# EAGLE design open-V2 (EAGLE 8.0.0)
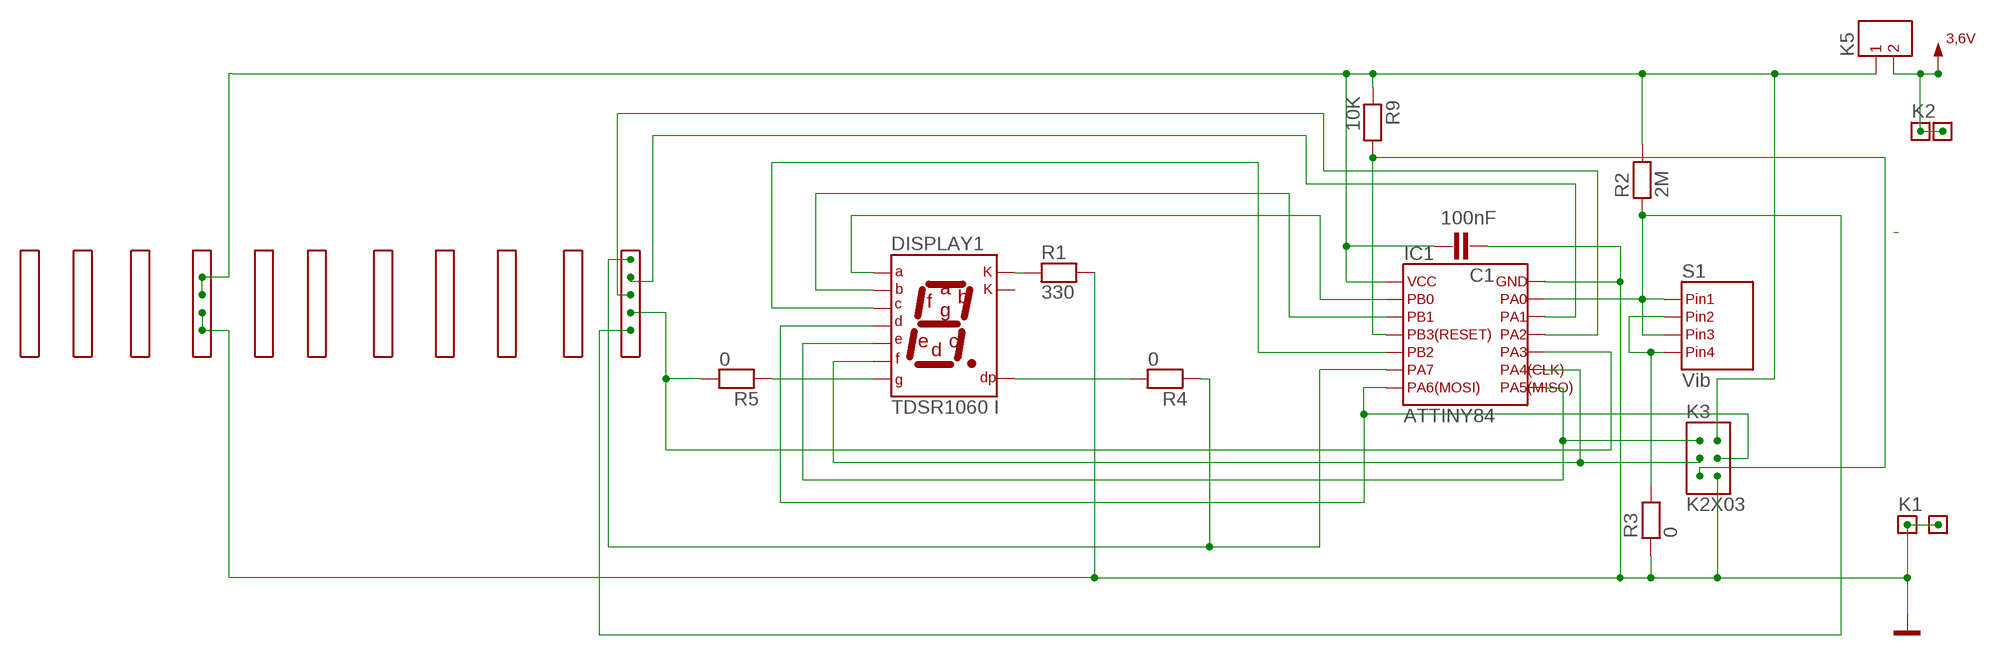
[diagram p0: schematic, sheet 1]

## Parts
C1  100nF  C1  [C1]
DISPLAY1  TDSR1060 I  DISPLAY1  [DISPLAY1]
IC1  ATTINY84  IC1  [IC1]
K1  K1  [K1]
K2  K2  [K2]
K3  K2X03  K3  [K3]
K4  K4  [K4]
K5  K5  [K5]
K6  K6  [K6]
K7  K7  [K7]
K8  K8  [K8]
K9  K9  [K9]
K10  K10  [K10]
K11  K11  [K11]
K12  K12  [K12]
K13  K13  [K13]
K14  K14  [K14]
K15  K15  [K15]
K16  K16  [K16]
K18  K18  [K18]
R1  330  R1  [R1]
R2  2M  R2  [R2]
R3  0  R3  [R3]
R4  0  R4  [R4]
R5  0  R5  [R5]
R9  10K  R9  [R9]
S1  Vib  S1  [S1]

## Nets
1: DISPLAY1.1(G) R5.1
3,6V: K2.1 K5.2 K18.1 ; supply symbol labelled VCC_1
A: DISPLAY1.10(A) IC1.2(PB0)
B: DISPLAY1.9(B) IC1.3(PB1)
C: DISPLAY1.7(C) IC1.5(PB2)
D/MOSI: DISPLAY1.5(D) IC1.7(PA6(MOSI)) K3.4
DP: DISPLAY1.6(DP) R4.2
E/MISO: DISPLAY1.4(E) IC1.8(PA5(MISO)) K3.1
F/CLK: DISPLAY1.2(F) IC1.9(PA4(CLK)) K3.3
G: IC1.10(PA3) K10.3 R5.2
GND: C1.1 IC1.14(GND) K1.1 K3.6 K13.2 K13.3 K16.1 R1.2 R3.1
K: DISPLAY1.3(K) R1.1
PA0: IC1.13(PA0) K10.2 R2.1 S1.1(PIN1) S1.3(PIN3)
PA1: IC1.12(PA1) K10.5
PA2: IC1.11(PA2) K10.4
PA7: IC1.6(PA7) K10.6 R4.1
RST: IC1.4(PB3(RESET)) K3.5 R9.2
SIG$25: R3.2 S1.2(PIN2) S1.4(PIN4)
VCC: C1.2 IC1.1(VCC) K3.2 K5.1 K13.4 K13.5 R2.2 R9.1
Unconnected: DISPLAY1.8(K) K4.1 K4.2 K4.3 K4.4 K4.5 K4.6 K6.1 K6.2 K6.3 K6.4 K6.5 K6.6 K7.1 K7.2 K7.3 K7.4 K7.5 K7.6 K8.1 K8.2 K8.3 K8.4 K8.5 K8.6 K9.1 K9.2 K9.3 K9.4 K9.5 K9.6 K10.1 K11.1 K11.2 K11.3 K11.4 K11.5 K11.6 K12.1 K12.2 K12.3 K12.4 K12.5 K12.6 K13.1 K13.6 K14.1 K14.2 K14.3 K14.4 K14.5 K14.6 K15.1 K15.2 K15.3 K15.4 K15.5 K15.6

## Library data of the parts
C1 = open-V2:C1: Bedrahtete Keramikkondensatoren, X7R/Z5U/Y5U, Kondensator 50V , B37982-N5104-M [100NF]
DISPLAY1 = open-V2:DISPLAY1: LED-Anzeigen, 10 mm, SA39-11EWA..., 7-Segment LED-Anzeige hyperrot, SC39-11SRWA [10MM]
IC1 = open-V2:IC1: 8-bit AVR Microcontroller with 2K Bytes In-System Programmable Flash
K1 = open-V2:K1: Pfostensteckverbinder 1-polig RM2,54
K2 = open-V2:K2: Pfostensteckverbinder 1-polig RM2,54
K3 = open-V2:K3: Pfostensteckverbinder 2x3-polig RM2,54
K4 = open-V2:K4: Pfostensteckverbinder 6-polig RM2,54
K5 = open-V2:K5: Jumper 2pol
K6 = open-V2:K6: Pfostensteckverbinder 6-polig RM2,54
K7 = open-V2:K7: Pfostensteckverbinder 6-polig RM2,54
K8 = open-V2:K8: Pfostensteckverbinder 6-polig RM2,54
K9 = open-V2:K9: Pfostensteckverbinder 6-polig RM2,54
K10 = open-V2:K10: Pfostensteckverbinder 6-polig RM2,54
K11 = open-V2:K11: Pfostensteckverbinder 6-polig RM2,54
K12 = open-V2:K12: Pfostensteckverbinder 6-polig RM2,54
K13 = open-V2:K13: Pfostensteckverbinder 6-polig RM2,54
K14 = open-V2:K14: Pfostensteckverbinder 6-polig RM2,54
K15 = open-V2:K15: Pfostensteckverbinder 6-polig RM2,54
K16 = open-V2:K16: Pfostensteckverbinder 1-polig RM2,54
K18 = open-V2:K18: Pfostensteckverbinder 1-polig RM2,54
R1 = open-V2:R1: Metallschichtwiderstand 330-Ohm, 0,6W, 1%
R2 = open-V2:R2: WIDERSTAND KOHLE 0,1 W 5% 470K BF 0204 1/10-Watt-Kohleschicht-Widerstände Bauform 0204 - Toleranz 5%. Wert 470 kOh
R3 = open-V2:R3: Metallschichtwiderstand 330-Ohm, 0,6W, 1%
R4 = open-V2:R4: WIDERSTAND KOHLE 0,1 W 5% 470K BF 0204 1/10-Watt-Kohleschicht-Widerstände Bauform 0204 - Toleranz 5%. Wert 470 kOh
R5 = open-V2:R5: WIDERSTAND KOHLE 0,1 W 5% 470K BF 0204 1/10-Watt-Kohleschicht-Widerstände Bauform 0204 - Toleranz 5%. Wert 470 kOh
R9 = open-V2:R9: WIDERSTAND KOHLE 0,1 W 5% 330R BF 0204 1/10-Watt-Kohleschicht-Widerstände Bauform 0204 - Toleranz 5%. Wert 330 Oh
S1 = open-V2:S1: Schalter

## Board
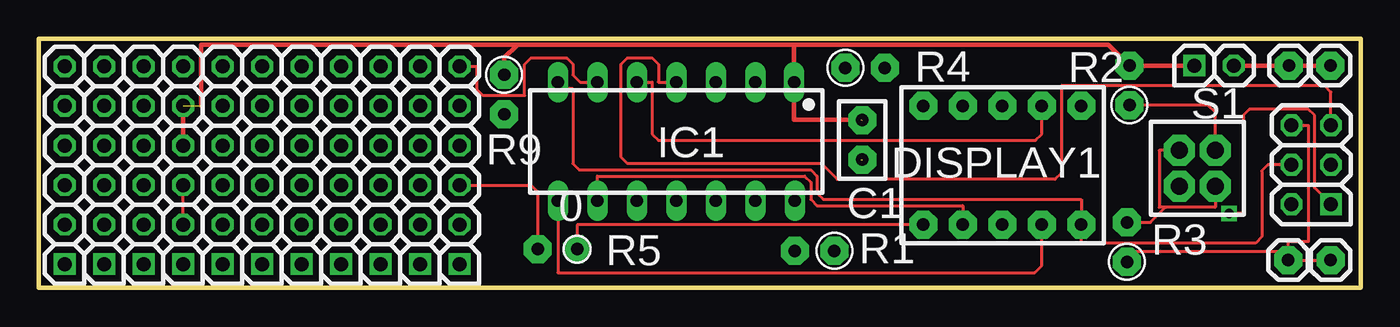
[diagram p1: board, top side]
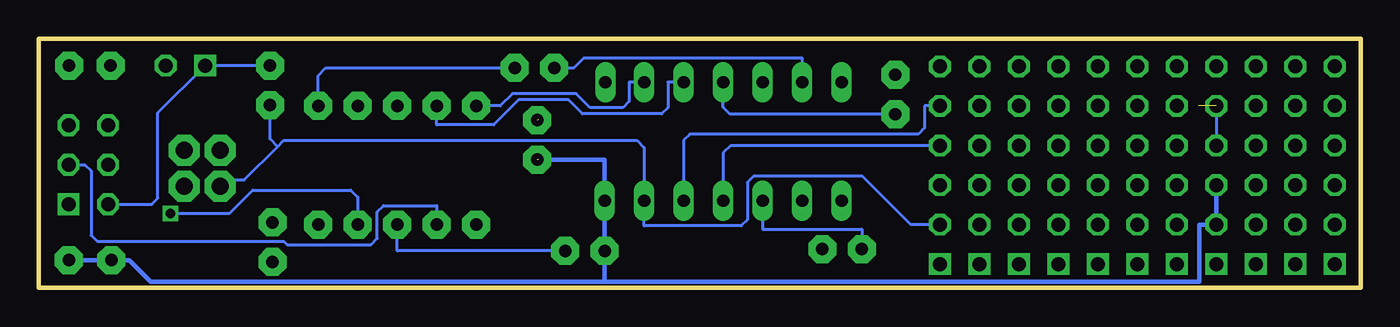
[diagram p2: board, bottom side, seen from below]

Size 85 x 16 mm. Coordinates in mm from the lower left corner, seen from the top.
Outline: 0,16 0,0 85,0 85,16 0,16
Copper layers (1*16): Top 0.035mm / dielectric 1.5mm / Bottom 0.035mm
Design rules "default": minimum track width 10mil, minimum drill 0.6mm, track to track 8mil, track to pad 8mil, pad to pad 8mil, via to via 8mil, smd to smd 8mil, copper to edge 40mil, drill to drill 8mil, minimum pad ring 10mil, minimum via ring 8mil, stop-mask expansion 4mil, vias tented up to drill 0mil, thermal gap 10mil

### Footprints (pad centres in the part's own frame; a part is rotated, then mirrored left to right if it is on the bottom)
C1 = drill 0.8 pad 1.8 octagon: 1 0,-1.27; 2 0,1.27
DISPLAY1 = drill 0.8 pad 1.8 octagon: 1 -5.107,-3.81; 2 -2.567,-3.81; 3 -0.027,-3.81; 4 2.513,-3.81; 5 5.053,-3.81; 6 5.053,3.81; 7 2.513,3.81; 8 -0.027,3.81; 9 -2.567,3.81; 10 -5.107,3.81
IC1 = drill 0.8 pad 1.25 long: 1 7.577,3.81; 2 5.08,3.81; 3 2.54,3.81; 4 0,3.81; 5 -2.54,3.81; 6 -5.08,3.81; 7 -7.62,3.81; 8 -7.62,-3.81; 9 -5.08,-3.81; 10 -2.54,-3.81; 11 0,-3.81; 12 2.54,-3.81; 13 5.08,-3.81; 14 7.62,-3.81
K1 = drill 0.8 pad 1.8 octagon: 1 0,0
K2 = drill 0.8 pad 1.8 octagon: 1 0,0
K3 = drill 0.9 pad 1.4 square: 1 0,0 | drill 0.9 pad 1.4 octagon: 2 -2.54,0; 3 0,2.54; 4 -2.54,2.54; 5 0,5.08; 6 -2.54,5.08
K4 = drill 0.9 pad 1.4 square: 1 0,0 | drill 0.9 pad 1.4 octagon: 2 0,2.54; 3 0,5.08; 4 0,7.62; 5 0,10.16; 6 0,12.7
K5 = drill 0.9 pad 1.4 square: 1 0,0 | drill 0.9 pad 1.4 octagon: 2 2.54,0
K6 = drill 0.9 pad 1.4 square: 1 0,0 | drill 0.9 pad 1.4 octagon: 2 0,2.54; 3 0,5.08; 4 0,7.62; 5 0,10.16; 6 0,12.7
K7 = drill 0.9 pad 1.4 square: 1 0,0 | drill 0.9 pad 1.4 octagon: 2 0,2.54; 3 0,5.08; 4 0,7.62; 5 0,10.16; 6 0,12.7
K8 = drill 0.9 pad 1.4 square: 1 0,0 | drill 0.9 pad 1.4 octagon: 2 0,2.54; 3 0,5.08; 4 0,7.62; 5 0,10.16; 6 0,12.7
K9 = drill 0.9 pad 1.4 square: 1 0,0 | drill 0.9 pad 1.4 octagon: 2 0,2.54; 3 0,5.08; 4 0,7.62; 5 0,10.16; 6 0,12.7
K10 = drill 0.9 pad 1.4 square: 1 0,0 | drill 0.9 pad 1.4 octagon: 2 0,2.54; 3 0,5.08; 4 0,7.62; 5 0,10.16; 6 0,12.7
K11 = drill 0.9 pad 1.4 square: 1 0,0 | drill 0.9 pad 1.4 octagon: 2 0,2.54; 3 0,5.08; 4 0,7.62; 5 0,10.16; 6 0,12.7
K12 = drill 0.9 pad 1.4 square: 1 0,0 | drill 0.9 pad 1.4 octagon: 2 0,2.54; 3 0,5.08; 4 0,7.62; 5 0,10.16; 6 0,12.7
K13 = drill 0.9 pad 1.4 square: 1 0,0 | drill 0.9 pad 1.4 octagon: 2 0,2.54; 3 0,5.08; 4 0,7.62; 5 0,10.16; 6 0,12.7
K14 = drill 0.9 pad 1.4 square: 1 0,0 | drill 0.9 pad 1.4 octagon: 2 0,2.54; 3 0,5.08; 4 0,7.62; 5 0,10.16; 6 0,12.7
K15 = drill 0.9 pad 1.4 square: 1 0,0 | drill 0.9 pad 1.4 octagon: 2 0,2.54; 3 0,5.08; 4 0,7.62; 5 0,10.16; 6 0,12.7
K16 = drill 0.8 pad 1.8 octagon: 1 0,0
K18 = drill 0.8 pad 1.8 octagon: 1 0,0
R1 = drill 0.8 pad 1.8 octagon: 1 0,0; 2 -2.54,0
R2 = drill 0.8 pad 1.8 octagon: 1 0,0; 2 0,2.54
R3 = drill 0.8 pad 1.8 octagon: 1 0,0; 2 0,2.54
R4 = drill 0.8 pad 1.8 octagon: 1 0,0; 2 2.54,0
R5 = drill 0.8 pad 1.8 octagon: 1 0,0; 2 -2.54,0
R9 = drill 0.8 pad 1.8 octagon: 1 0,0; 2 0,-2.54
S1 = drill 1.1 pad 2 octagon: 1 -1.1,-1.15; 2 -1.1,1.15; 3 1.2,1.15; 4 1.2,-1.15

### Placement (x,y rotation side)
C1  52.95,9.5 0 top
DISPLAY1  61.98,7.88 0 top
IC1  40.99,9.4 0 top
K1  80.34,1.77 0 top
K2  80.39,14.29 0 top
K3  83.09,5.37 0 top
K4  14.35,1.53 0 top
K5  74.31,14.29 0 top
K6  16.89,1.53 0 top
K7  19.43,1.53 0 top
K8  21.97,1.53 0 top
K9  24.51,1.53 0 top
K10  27.05,1.53 0 top
K11  1.65,1.53 0 top
K12  11.81,1.53 0 top
K13  9.27,1.53 0 top
K14  4.19,1.53 0 top
K15  6.73,1.53 0 top
K16  83.08,1.77 0 top
K18  83.06,14.29 0 top
R1  51.16,2.38 0 top
R2  70.14,11.75 0 top
R3  69.98,1.67 0 top
R4  51.86,14.13 0 top
R5  34.61,2.48 0 top
R9  29.92,13.7 0 top
S1  74.45,7.68 0 top

### Tracks (layer width: path | path; a pad name or v marks a point on that pad's centre or on a via)
1
  Top 0.2: DISPLAY1.1 56.87,4.04 34.61,4.04 R5.1
3,6V
  Top 0.3: K18.1 K2.1 K5.2
A
  Bottom 0.2: IC1.2 47.04,13.21 47.04,11.98 47.44,11.58 49.54,11.58 50.44,12.48 54.54,12.48 55.33,11.69 DISPLAY1.10
B
  Bottom 0.2: IC1.3 44.54,13.21 44.54,11.58 44.94,11.18 50.04,11.18 50.94,12.08 54.14,12.08 55.74,10.48 59.41,10.48 DISPLAY1.9
C
  Top 0.2: IC1.5 39.44,13.21 39.44,9.88 39.84,9.48 64.09,9.48 64.49,9.88 DISPLAY1.7
D/MOSI
  Top 0.2: IC1.7 33.37,12.81 34.34,12.81 34.34,7.98 34.74,7.58 49.64,7.58 50.04,7.18 50.04,6.08 50.44,5.68 67.03,5.68 DISPLAY1.5 67.03,2.88 78.24,2.88 78.64,3.28 78.64,7.51 79.04,7.91 K3.4
DP
  Bottom 0.2: DISPLAY1.6 67.03,13.65 66.54,14.13 R4.2
E/MISO  (via drill 0.6)  (1 unrouted)
  Top 0.2: IC1.8 33.37,0.98 64.04,0.98 64.49,1.42 DISPLAY1.4 | K3.1 82.04,6.42 82.04,11.08 81.64,11.48 77.84,11.48 77.44,11.08 77.44,4.78 v76.54,4.78
  Bottom 0.2: v76.54,4.78 72.74,4.78 71.24,6.28 64.94,6.28 64.49,5.82 DISPLAY1.4
F/CLK
  Top 0.2: IC1.9 35.91,7.18 49.24,7.18 49.64,6.78 49.64,5.68 50.04,5.28 59.41,5.28 DISPLAY1.2
  Bottom 0.2: K3.3 82.04,7.91 81.64,7.51 81.64,3.38 81.24,2.98 69.24,2.98 69.04,2.78 63.64,2.78 63.24,3.18 63.24,4.88 62.84,5.28 59.41,5.28 DISPLAY1.2
G
  Top 0.2: K10.3 31.64,6.61 32.07,6.18 R5.2
  Bottom 0.2: IC1.10 38.45,3.78 32.07,3.78 R5.2
GND  (1 unrouted)
  Top 0.2: K16.1 K1.1 80.34,2.34 | 80.34,2.34 80.34,2.98 81.64,2.98 81.64,10.45 K3.6 | R3.1 69.98,2.34 80.34,2.34 | K13.2 K13.3
  Bottom 0.3: K13.3 K13.2 10.38,4.07 10.38,0.4 48.62,0.4 | 48.62,0.4 48.65,0.4 77.81,0.4 79.18,1.77 K1.1 K16.1 | 52.87,8.25 48.61,8.25 IC1.14 R1.2 48.62,0.4
K
  Bottom 0.2: R1.1 61.95,2.38 DISPLAY1.3
PA0
  Top 0.2: S1.3 75.65,11.28 75.18,11.75 R2.1
  Bottom 0.2: K10.2 28.93,4.07 32.04,7.18 39.04,7.18 39.44,6.78 39.44,4.38 39.84,3.98 46.07,3.98 IC1.13 46.07,9.01 46.54,9.48 69.24,9.48 69.64,9.08 | S1.1 73.35,6.93 71.79,6.93 69.64,9.08 | 69.64,9.08 70.14,9.57 R2.1
PA1
  Bottom 0.2: K10.5 28.04,11.69 28.04,10.28 28.44,9.88 43.13,9.88 43.53,9.48 IC1.12
PA2
  Bottom 0.2: K10.4 40.52,9.15 40.99,8.68 IC1.11
PA7
  Top 0.2: K10.6 28.14,14.23 28.14,12.78 28.54,12.38 31.24,12.38 31.24,14.38 31.64,14.78 33.94,14.78 34.34,14.38 34.34,13.68 34.8,13.21 IC1.6
  Bottom 0.2: R4.1 50.59,14.13 49.94,14.78 35.91,14.78 IC1.6
RST
  Top 0.2: K3.5 83.09,12.58 82.69,12.98 65.74,12.98 65.74,7.38 65.34,6.98 51.34,6.98 50.34,7.98 37.84,7.98 37.44,8.38 37.44,14.38 37.84,14.78 39.44,14.78 39.84,14.38 39.84,13.21 IC1.4
  Bottom 0.2: R9.2 40.54,11.16 40.99,11.61 IC1.4
SIG$25
  Top 0.2: S1.4 75.65,5.18 72.44,5.18 | 72.44,5.18 72.04,5.18 72.04,8.83 S1.2 | R3.2 71.48,4.21 72.44,5.18
VCC  (2 unrouted)
  Top 0.3: 10.44,11.69 10.44,15.64 30.77,15.64 | 48.57,15.64 30.77,15.64 | 52.87,10.79 48.57,10.79 IC1.1 48.57,15.64 | 29.92,14.41 R9.1 29.91,14.77 30.77,15.64 | K5.1 R2.2 68.78,15.64 48.57,15.64 | K13.5 K13.4
  Bottom 0.2: K3.2 77.74,5.37 77.34,5.77 77.34,11.25 K5.1 R2.2 | K13.5 K13.4